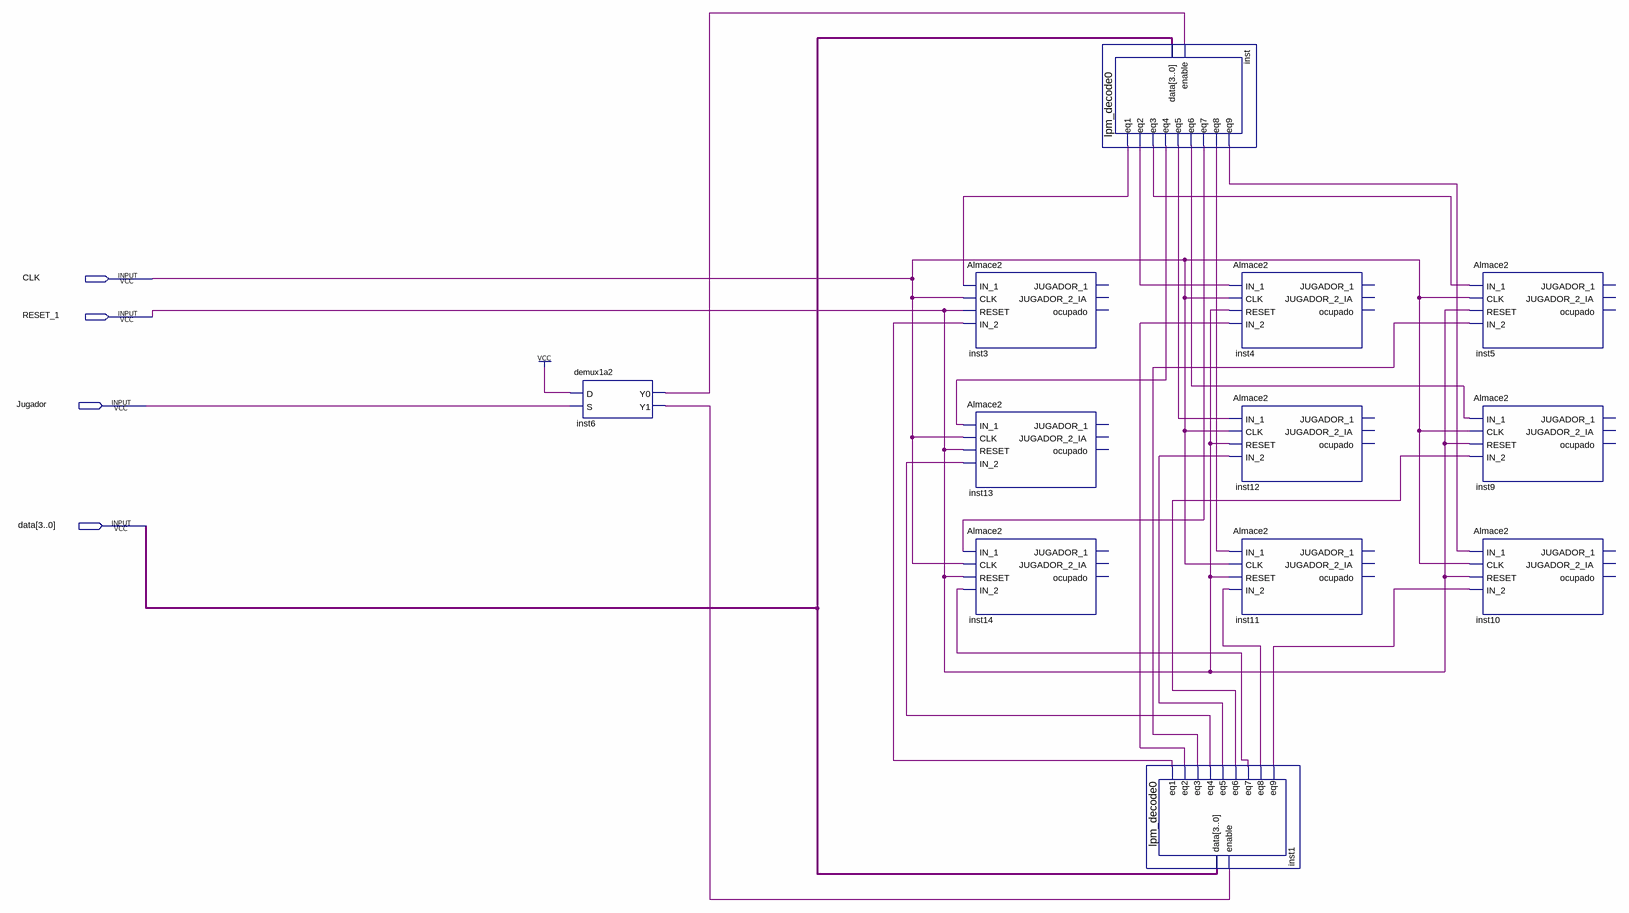
[diagram p0: schematic sheet]
// Quartus schematic jugadas_full2.bdf as structural Verilog: 12 symbols, 4 pins
module jugadas_full2 (
  input  CLK,
  input  RESET_1,
  input  Jugador,
  input  [3:0] data
);

  wire inst1_eq1, inst1_eq2, inst1_eq3, inst1_eq4, inst1_eq5, inst1_eq6, inst1_eq7, inst1_eq8, inst1_eq9,
       inst6_y0, inst6_y1, inst_eq1, inst_eq2, inst_eq3, inst_eq4, inst_eq5, inst_eq6, inst_eq7, inst_eq8,
       inst_eq9;

  demux1a2 inst6 (.D(1'b1), .S(Jugador), .Y0(inst6_y0), .Y1(inst6_y1));
  Almace2 inst3 (
    .IN_1(inst_eq1), .CLK(CLK), .RESET(RESET_1), .IN_2(inst1_eq1));  // open: JUGADOR_1, JUGADOR_2_IA, ocupado
  Almace2 inst13 (
    .IN_1(inst_eq4), .CLK(CLK), .RESET(RESET_1), .IN_2(inst1_eq4));  // open: JUGADOR_1, JUGADOR_2_IA, ocupado
  Almace2 inst14 (
    .IN_1(inst_eq7), .CLK(CLK), .RESET(RESET_1), .IN_2(inst1_eq7));  // open: JUGADOR_1, JUGADOR_2_IA, ocupado
  lpm_decode0 inst (
    .data(data), .enable(inst6_y0), .eq1(inst_eq1), .eq2(inst_eq2), .eq3(inst_eq3), .eq4(inst_eq4),
    .eq5(inst_eq5), .eq6(inst_eq6), .eq7(inst_eq7), .eq8(inst_eq8), .eq9(inst_eq9));
  lpm_decode0 inst1 (
    .data(data), .enable(inst6_y1), .eq1(inst1_eq1), .eq2(inst1_eq2), .eq3(inst1_eq3), .eq4(inst1_eq4),
    .eq5(inst1_eq5), .eq6(inst1_eq6), .eq7(inst1_eq7), .eq8(inst1_eq8), .eq9(inst1_eq9));
  Almace2 inst4 (
    .IN_1(inst_eq2), .CLK(CLK), .RESET(RESET_1), .IN_2(inst1_eq2));  // open: JUGADOR_1, JUGADOR_2_IA, ocupado
  Almace2 inst12 (
    .IN_1(inst_eq5), .CLK(CLK), .RESET(RESET_1), .IN_2(inst1_eq5));  // open: JUGADOR_1, JUGADOR_2_IA, ocupado
  Almace2 inst11 (
    .IN_1(inst_eq8), .CLK(CLK), .RESET(RESET_1), .IN_2(inst1_eq8));  // open: JUGADOR_1, JUGADOR_2_IA, ocupado
  Almace2 inst5 (
    .IN_1(inst_eq3), .CLK(CLK), .RESET(RESET_1), .IN_2(inst1_eq3));  // open: JUGADOR_1, JUGADOR_2_IA, ocupado
  Almace2 inst9 (
    .IN_1(inst_eq6), .CLK(CLK), .RESET(RESET_1), .IN_2(inst1_eq6));  // open: JUGADOR_1, JUGADOR_2_IA, ocupado
  Almace2 inst10 (
    .IN_1(inst_eq9), .CLK(CLK), .RESET(RESET_1), .IN_2(inst1_eq9));  // open: JUGADOR_1, JUGADOR_2_IA, ocupado
endmodule
